# Altium schematic sheet [13]-LED_INDICATION.SchDoc
size A4
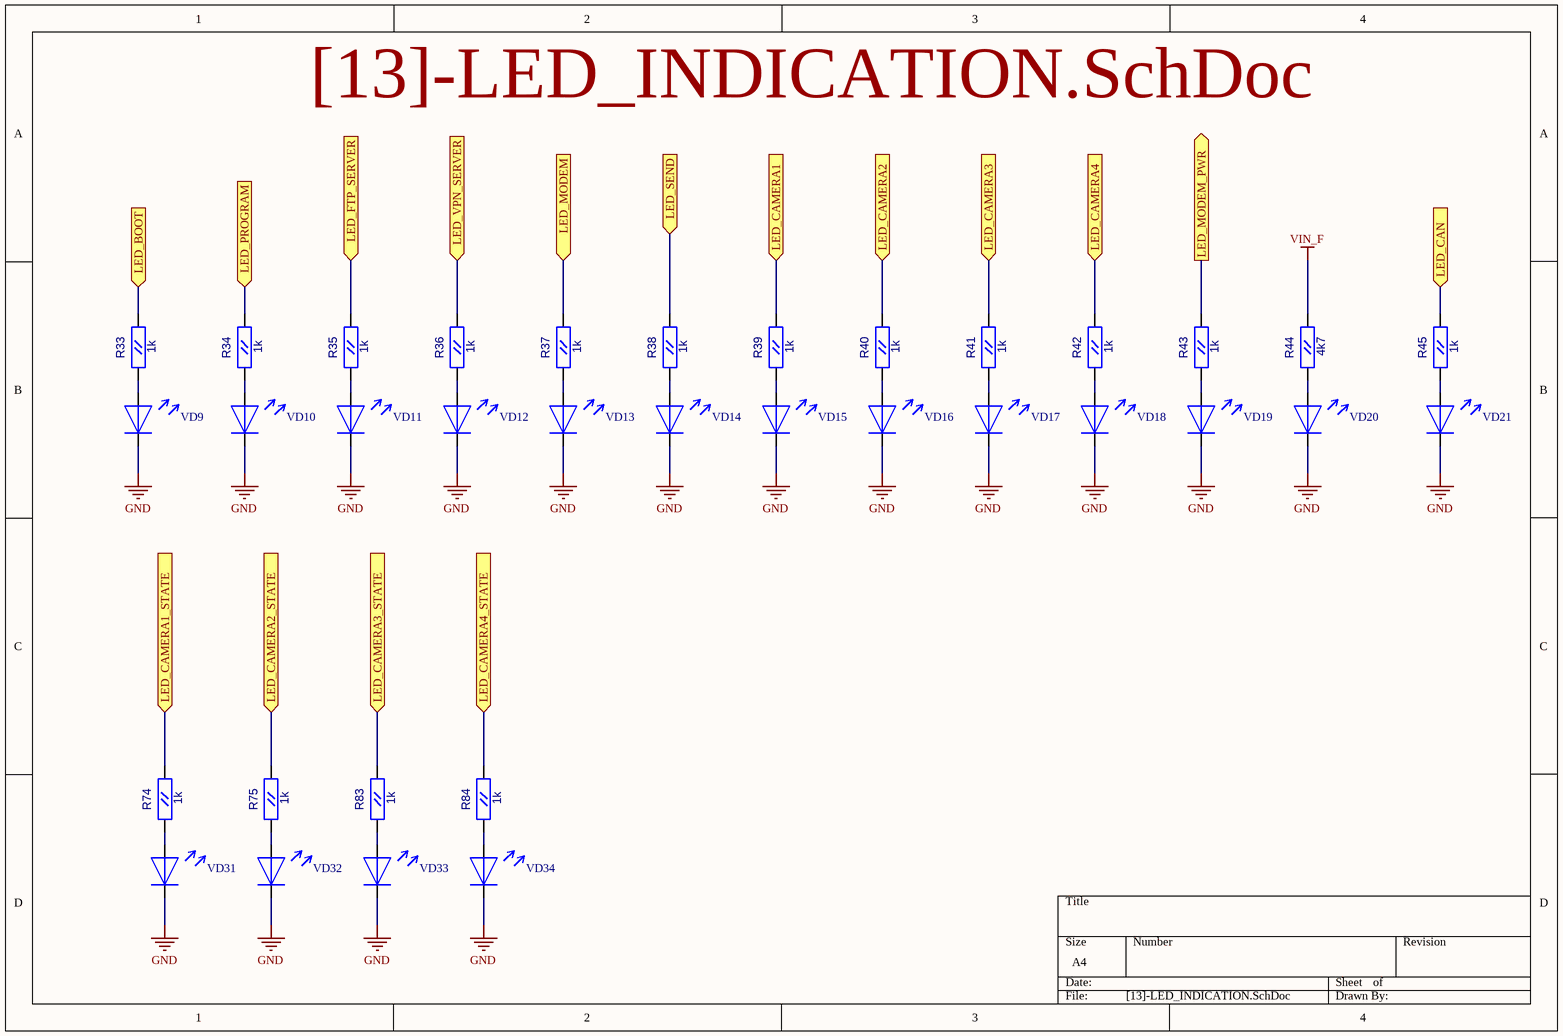
[diagram p0: [13]-LED_INDICATION.SchDoc]

## Parts
R33  1k  [RC0603]
R34  1k  [RC0603]
R35  1k  [RC0603]
R36  1k  [RC0603]
R37  1k  [RC0603]
R38  1k  [RC0603]
R39  1k  [RC0603]
R40  1k  [RC0603]
R41  1k  [RC0603]
R42  1k  [RC0603]
R43  1k  [RC0603]
R44  4k7  [RC0603]
R45  1k  [RC0603]
R74  1k  [RC0603]
R75  1k  [RC0603]
R83  1k  [RC0603]
R84  1k  [RC0603]
VD9  LED_0805  [LED0805]  (value not drawn)
VD10  LED_0805  [LED0805]  (value not drawn)
VD11  LED_0805  [LED0805]  (value not drawn)
VD12  LED_0805  [LED0805]  (value not drawn)
VD13  LED_0805  [LED0805]  (value not drawn)
VD14  LED_0805  [LED0805]  (value not drawn)
VD15  LED_0805  [LED0805]  (value not drawn)
VD16  LED_0805  [LED0805]  (value not drawn)
VD17  LED_0805  [LED0805]  (value not drawn)
VD18  LED_0805  [LED0805]  (value not drawn)
VD19  LED_0805  [LED0805]  (value not drawn)
VD20  LED_0805  [LED0805]  (value not drawn)
VD21  LED_0805  [LED0805]  (value not drawn)
VD31  LED_0805  [LED0805]  (value not drawn)
VD32  LED_0805  [LED0805]  (value not drawn)
VD33  LED_0805  [LED0805]  (value not drawn)
VD34  LED_0805  [LED0805]  (value not drawn)

## Ports
LED_BOOT (in), LED_CAMERA1 (in), LED_CAMERA1_STATE (in), LED_CAMERA2 (in), LED_CAMERA2_STATE (in), LED_CAMERA3 (in), LED_CAMERA3_STATE (in), LED_CAMERA4 (in), LED_CAMERA4_STATE (in), LED_CAN (in), LED_FTP_SERVER (in), LED_MODEM (in), LED_MODEM_PWR (out), LED_PROGRAM (in), LED_SEND (in), LED_VPN_SERVER (in)

## Nets
GND: VD9.2 VD10.2 VD11.2 VD12.2 VD13.2 VD14.2 VD15.2 VD16.2 VD17.2 VD18.2 VD19.2 VD20.2 VD21.2 VD31.2 VD32.2 VD33.2 VD34.2
VIN_F: R44.2(B)
LED_BOOT: R33.2(B) ; port LED_BOOT
LED_CAMERA1: R39.2(B) ; port LED_CAMERA1
LED_CAMERA1_STATE: R74.2(B) ; port LED_CAMERA1_STATE
LED_CAMERA2: R40.2(B) ; port LED_CAMERA2
LED_CAMERA2_STATE: R75.2(B) ; port LED_CAMERA2_STATE
LED_CAMERA3: R41.2(B) ; port LED_CAMERA3
LED_CAMERA3_STATE: R83.2(B) ; port LED_CAMERA3_STATE
LED_CAMERA4: R42.2(B) ; port LED_CAMERA4
LED_CAMERA4_STATE: R84.2(B) ; port LED_CAMERA4_STATE
LED_CAN: R45.2(B) ; port LED_CAN
LED_FTP_SERVER: R35.2(B) ; port LED_FTP_SERVER
LED_MODEM: R37.2(B) ; port LED_MODEM
LED_MODEM_PWR: R43.2(B) ; port LED_MODEM_PWR
LED_PROGRAM: R34.2(B) ; port LED_PROGRAM
LED_SEND: R38.2(B) ; port LED_SEND
LED_VPN_SERVER: R36.2(B) ; port LED_VPN_SERVER
NetR33_1: R33.1(A) VD9.1
NetR34_1: R34.1(A) VD10.1
NetR35_1: R35.1(A) VD11.1
NetR36_1: R36.1(A) VD12.1
NetR37_1: R37.1(A) VD13.1
NetR38_1: R38.1(A) VD14.1
NetR39_1: R39.1(A) VD15.1
NetR40_1: R40.1(A) VD16.1
NetR41_1: R41.1(A) VD17.1
NetR42_1: R42.1(A) VD18.1
NetR43_1: R43.1(A) VD19.1
NetR44_1: R44.1(A) VD20.1
NetR45_1: R45.1(A) VD21.1
NetR74_1: R74.1(A) VD31.1
NetR75_1: R75.1(A) VD32.1
NetR83_1: R83.1(A) VD33.1
NetR84_1: R84.1(A) VD34.1

## Library data of the parts
R33-R45 R74 R75 R83 R84 = RC0603
  R33-R43 R45 R74 R75 R83 R84: Value: 1k
  R44: Value: 4k7
VD9-VD21 VD31-VD34 = LED_0805: Value: LED_0805